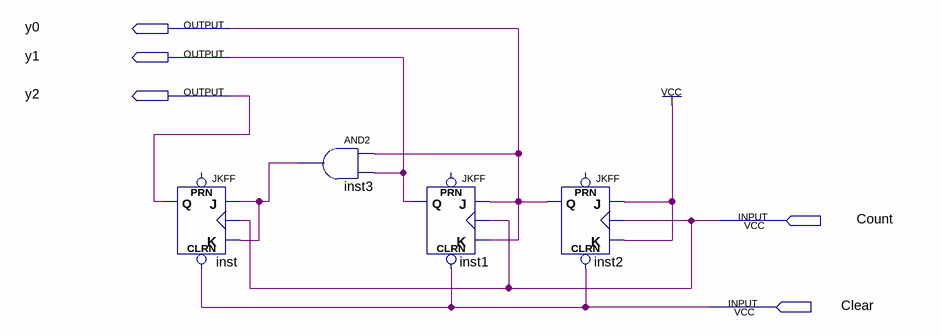
[diagram p0: schematic sheet]
// Quartus schematic BinCounter.bdf as structural Verilog: 4 symbols, 5 pins
module BinCounter (
  input  Count,
  input  Clear,
  output y0,
  output y1,
  output y2
);

  wire inst3_out;

  JKFF inst (.CLRN(Clear), .K(inst3_out), .J(inst3_out), .CLK(Count), .Q(y2));  // open: PRN
  and inst3 (inst3_out, y0, y1);
  JKFF inst1 (.CLRN(Clear), .K(y0), .J(y0), .CLK(Count), .Q(y1));  // open: PRN
  JKFF inst2 (.CLRN(Clear), .K(1'b1), .J(1'b1), .CLK(Count), .Q(y0));  // open: PRN
endmodule
